# EAGLE design 3-channel_geo_amplifier (EAGLE 7.2.0)
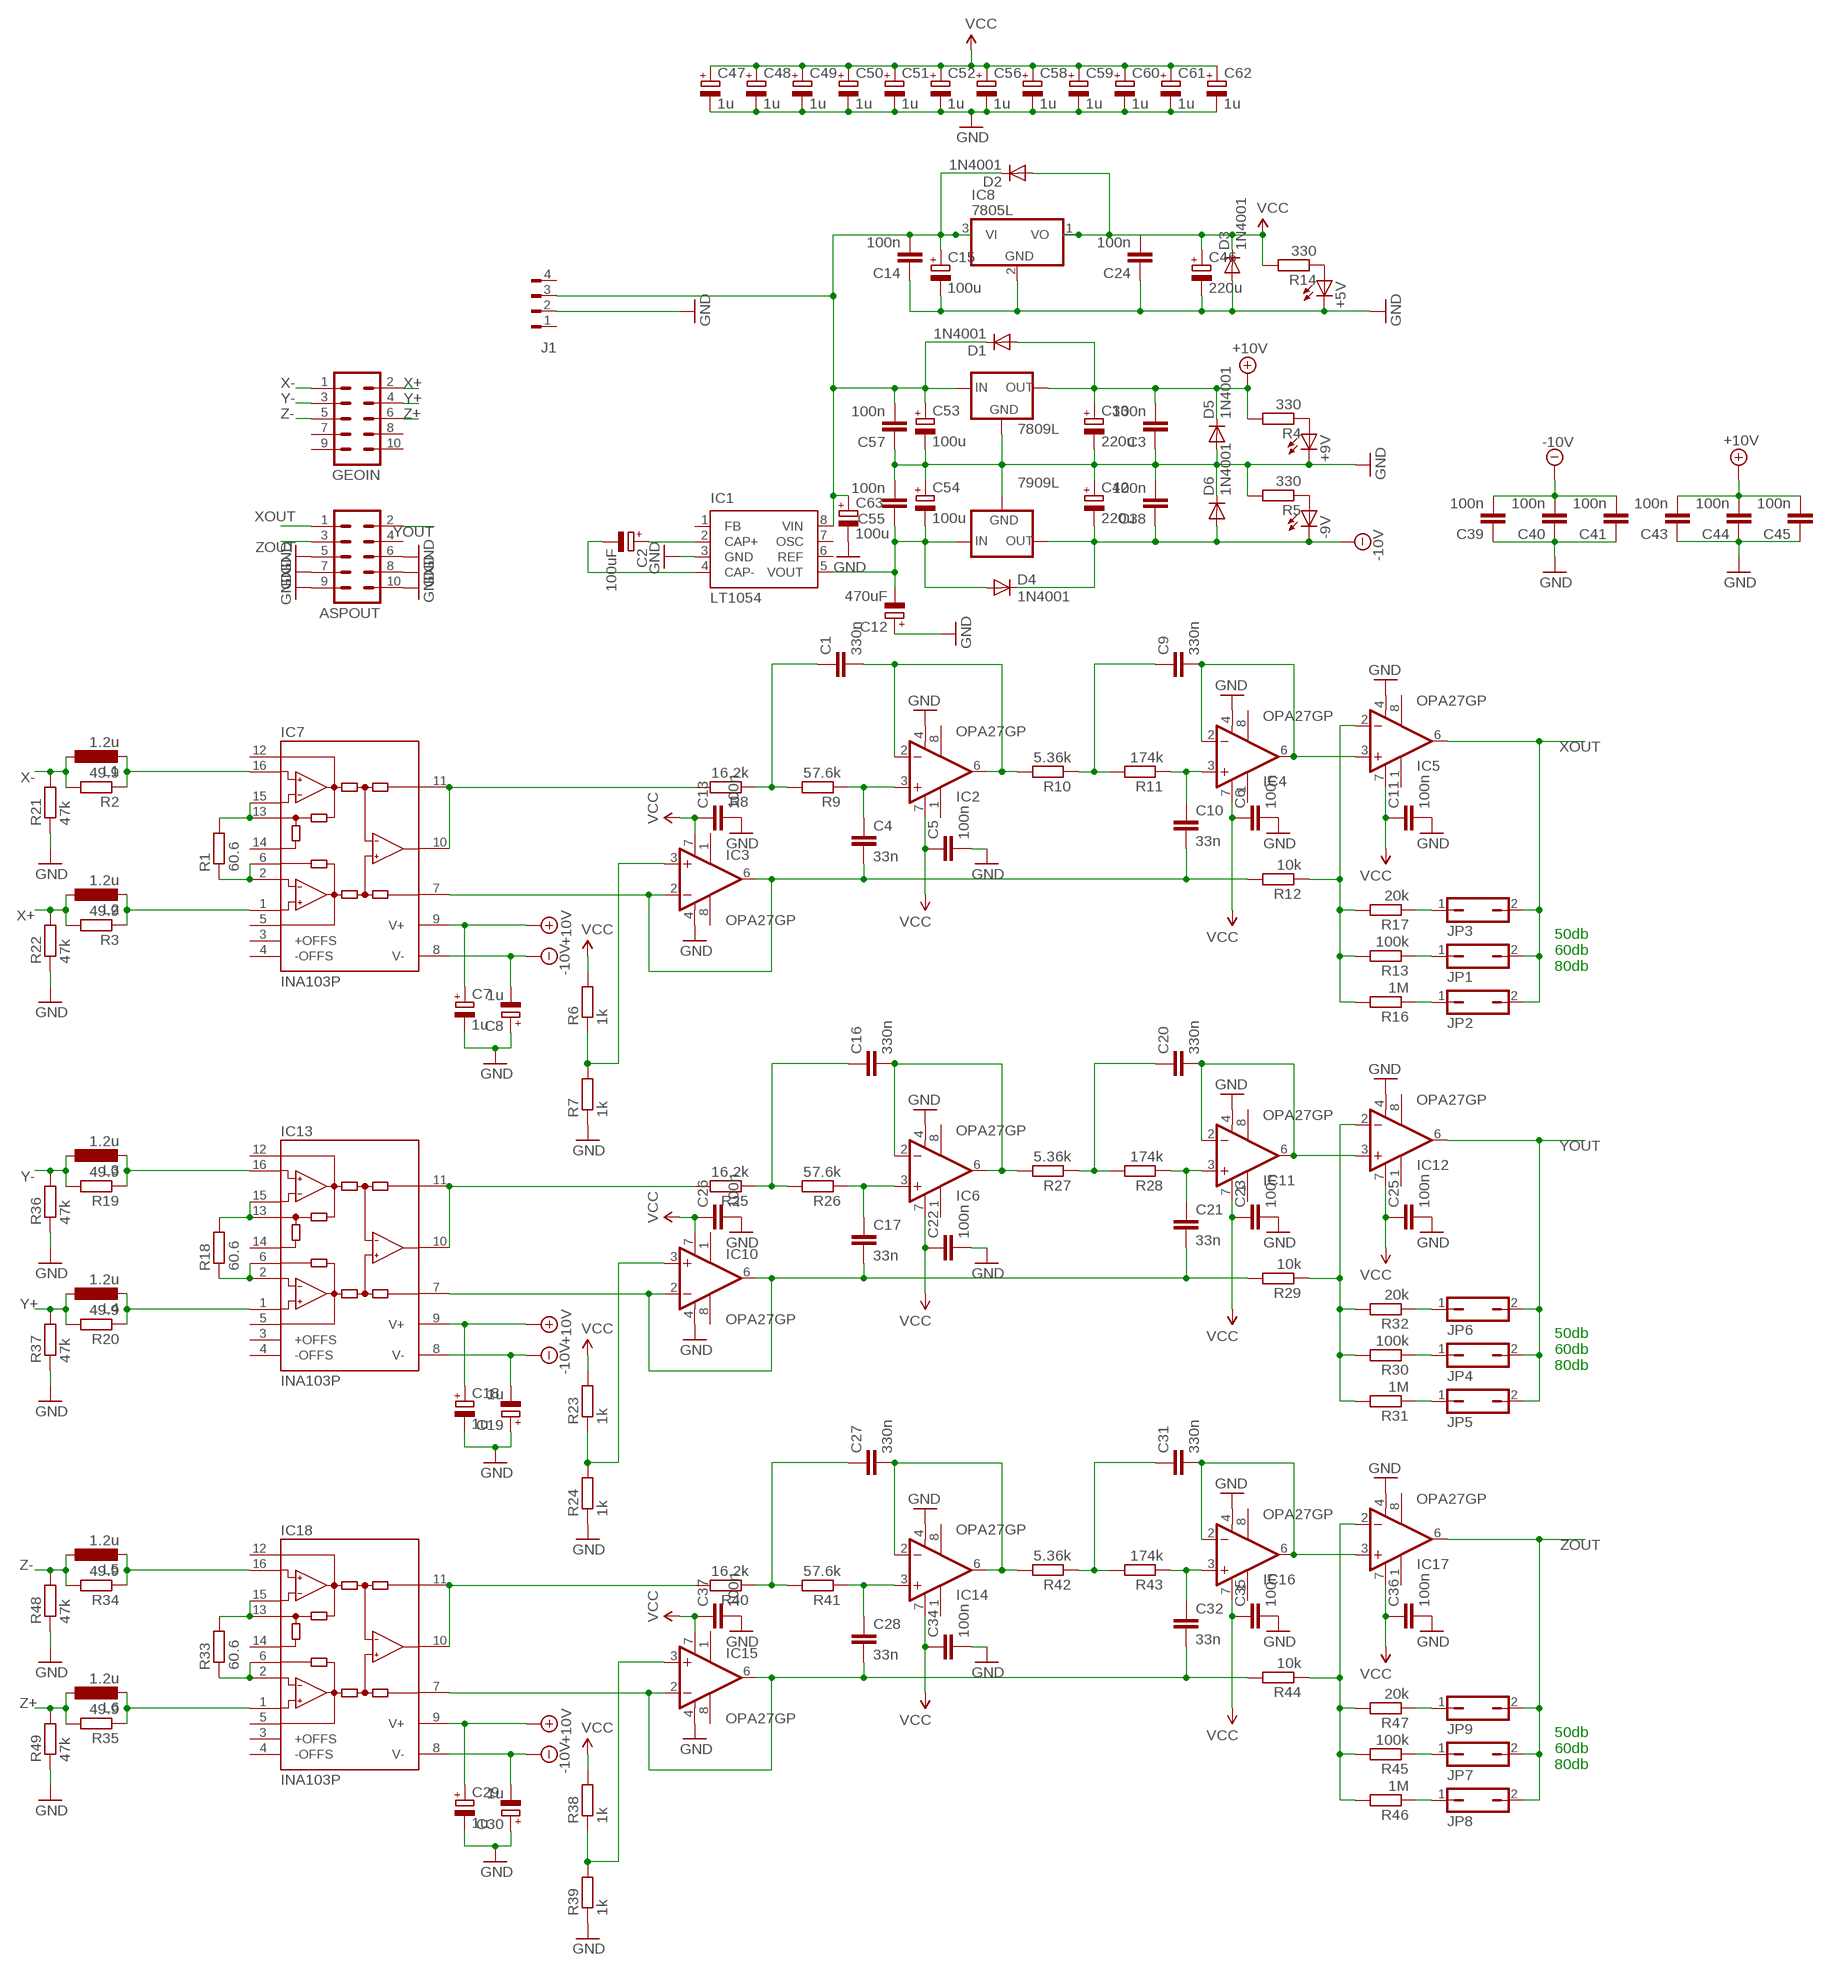
[diagram p0: schematic, sheet 1]

## Parts
7809L  78LXX  [78LXX]
7909L  79LXX  [79LXX]
+5V  LED3MM  [LED3MM]
+9V  LED3MM  [LED3MM]
-9V  LED3MM  [LED3MM]
ASPOUT  ML10  [ML10]
C1  330n  C-EU050-025X075  [C050-025X075]
C2  100uF  CPOL-EUE2.5-7  [E2,5-7]
C3  100n  C-EU050-025X075  [C050-025X075]
C4  33n  C-EU050-025X075  [C050-025X075]
C5  100n  C-EU050-025X075  [C050-025X075]
C6  100n  C-EU050-025X075  [C050-025X075]
C7  1u  CPOL-EUB45181A  [B45181A]
C8  1u  CPOL-EUB45181A  [B45181A]
C9  330n  C-EU050-025X075  [C050-025X075]
C10  33n  C-EU050-025X075  [C050-025X075]
C11  100n  C-EU050-025X075  [C050-025X075]
C12  470uF  CPOL-EUE5-8.5  [E5-8,5]
C13  100n  C-EU050-025X075  [C050-025X075]
C14  100n  C-EU050-025X075  [C050-025X075]
C15  100u  CPOL-EUE2.5-7  [E2,5-7]
C16  330n  C-EU050-025X075  [C050-025X075]
C17  33n  C-EU050-025X075  [C050-025X075]
C18  1u  CPOL-EUB45181A  [B45181A]
C19  1u  CPOL-EUB45181A  [B45181A]
C20  330n  C-EU050-025X075  [C050-025X075]
C21  33n  C-EU050-025X075  [C050-025X075]
C22  100n  C-EU050-025X075  [C050-025X075]
C23  100n  C-EU050-025X075  [C050-025X075]
C24  100n  C-EU050-025X075  [C050-025X075]
C25  100n  C-EU050-025X075  [C050-025X075]
C26  100n  C-EU050-025X075  [C050-025X075]
C27  330n  C-EU050-025X075  [C050-025X075]
C28  33n  C-EU050-025X075  [C050-025X075]
C29  1u  CPOL-EUB45181A  [B45181A]
C30  1u  CPOL-EUB45181A  [B45181A]
C31  330n  C-EU050-025X075  [C050-025X075]
C32  33n  C-EU050-025X075  [C050-025X075]
C33  220u  CPOL-EUE2.5-5  [E2,5-5]
C34  100n  C-EU050-025X075  [C050-025X075]
C35  100n  C-EU050-025X075  [C050-025X075]
C36  100n  C-EU050-025X075  [C050-025X075]
C37  100n  C-EU050-025X075  [C050-025X075]
C38  100n  C-EU050-025X075  [C050-025X075]
C39  100n  C-EU050-025X075  [C050-025X075]
C40  100n  C-EU050-025X075  [C050-025X075]
C41  100n  C-EU050-025X075  [C050-025X075]
C42  220u  CPOL-EUE2.5-5  [E2,5-5]
C43  100n  C-EU050-025X075  [C050-025X075]
C44  100n  C-EU050-025X075  [C050-025X075]
C45  100n  C-EU050-025X075  [C050-025X075]
C46  220u  CPOL-EUE2.5-7  [E2,5-7]
C47  1u  CPOL-EUB45181A  [B45181A]
C48  1u  CPOL-EUB45181A  [B45181A]
C49  1u  CPOL-EUB45181A  [B45181A]
C50  1u  CPOL-EUB45181A  [B45181A]
C51  1u  CPOL-EUB45181A  [B45181A]
C52  1u  CPOL-EUB45181A  [B45181A]
C53  100u  CPOL-EUE2.5-5  [E2,5-5]
C54  100u  CPOL-EUE2.5-5  [E2,5-5]
C55  100n  C-EU050-025X075  [C050-025X075]
C56  1u  CPOL-EUB45181A  [B45181A]
C57  100n  C-EU050-025X075  [C050-025X075]
C58  1u  CPOL-EUB45181A  [B45181A]
C59  1u  CPOL-EUB45181A  [B45181A]
C60  1u  CPOL-EUB45181A  [B45181A]
C61  1u  CPOL-EUB45181A  [B45181A]
C62  1u  CPOL-EUB45181A  [B45181A]
C63  100u  CPOL-EUE2.5-5  [E2,5-5]
D1  1N4001  1N4004  [DO41-10]
D2  1N4001  1N4004  [DO41-10]
D3  1N4001  1N4004  [DO41-10]
D4  1N4001  1N4004  [DO41-10]
D5  1N4001  1N4004  [DO41-10]
D6  1N4001  1N4004  [DO41-10]
GEOIN  ML10  [ML10]
IC1  LT1054  [DIL8]
IC2  OPA27GP  [DIL08]
IC3  OPA27GP  [DIL08]
IC4  OPA27GP  [DIL08]
IC5  OPA27GP  [DIL08]
IC6  OPA27GP  [DIL08]
IC7  INA103P  [DIL16]
IC8  7805L  [TO92]
IC10  OPA27GP  [DIL08]
IC11  OPA27GP  [DIL08]
IC12  OPA27GP  [DIL08]
IC13  INA103P  [DIL16]
IC14  OPA27GP  [DIL08]
IC15  OPA27GP  [DIL08]
IC16  OPA27GP  [DIL08]
IC17  OPA27GP  [DIL08]
IC18  INA103P  [DIL16]
J1  FLOP-4W827001  [827001]
JP1  JP1Q  [JP1]
JP2  JP1Q  [JP1]
JP3  JP1Q  [JP1]
JP4  JP1Q  [JP1]
JP5  JP1Q  [JP1]
JP6  JP1Q  [JP1]
JP7  JP1Q  [JP1]
JP8  JP1Q  [JP1]
JP9  JP1Q  [JP1]
L1  1.2u  L-EU0207/10  [0207/10]
L2  1.2u  L-EU0207/10  [0207/10]
L3  1.2u  L-EU0207/10  [0207/10]
L4  1.2u  L-EU0207/10  [0207/10]
L5  1.2u  L-EU0207/10  [0207/10]
L6  1.2u  L-EU0207/10  [0207/10]
R1  60.6  R-EU_0207/10  [0207/10]
R2  49.9  R-EU_0207/10  [0207/10]
R3  49.9  R-EU_0207/10  [0207/10]
R4  330  R-EU_0207/10  [0207/10]
R5  330  R-EU_0207/10  [0207/10]
R6  1k  R-EU_0207/10  [0207/10]
R7  1k  R-EU_0207/10  [0207/10]
R8  16.2k  R-EU_0207/10  [0207/10]
R9  57.6k  R-EU_0207/10  [0207/10]
R10  5.36k  R-EU_0207/10  [0207/10]
R11  174k  R-EU_0207/10  [0207/10]
R12  10k  R-EU_0207/10  [0207/10]
R13  100k  R-EU_0207/10  [0207/10]
R14  330  R-EU_0207/10  [0207/10]
R16  1M  R-EU_0207/10  [0207/10]
R17  20k  R-EU_0207/10  [0207/10]
R18  60.6  R-EU_0207/10  [0207/10]
R19  49.9  R-EU_0207/10  [0207/10]
R20  49.9  R-EU_0207/10  [0207/10]
R21  47k  R-EU_0207/10  [0207/10]
R22  47k  R-EU_0207/10  [0207/10]
R23  1k  R-EU_0207/10  [0207/10]
R24  1k  R-EU_0207/10  [0207/10]
R25  16.2k  R-EU_0207/10  [0207/10]
R26  57.6k  R-EU_0207/10  [0207/10]
R27  5.36k  R-EU_0207/10  [0207/10]
R28  174k  R-EU_0207/10  [0207/10]
R29  10k  R-EU_0207/10  [0207/10]
R30  100k  R-EU_0207/10  [0207/10]
R31  1M  R-EU_0207/10  [0207/10]
R32  20k  R-EU_0207/10  [0207/10]
R33  60.6  R-EU_0207/10  [0207/10]
R34  49.9  R-EU_0207/10  [0207/10]
R35  49.9  R-EU_0207/10  [0207/10]
R36  47k  R-EU_0207/10  [0207/10]
R37  47k  R-EU_0207/10  [0207/10]
R38  1k  R-EU_0207/10  [0207/10]
R39  1k  R-EU_0207/10  [0207/10]
R40  16.2k  R-EU_0207/10  [0207/10]
R41  57.6k  R-EU_0207/10  [0207/10]
R42  5.36k  R-EU_0207/10  [0207/10]
R43  174k  R-EU_0207/10  [0207/10]
R44  10k  R-EU_0207/10  [0207/10]
R45  100k  R-EU_0207/10  [0207/10]
R46  1M  R-EU_0207/10  [0207/10]
R47  20k  R-EU_0207/10  [0207/10]
R48  47k  R-EU_0207/10  [0207/10]
R49  47k  R-EU_0207/10  [0207/10]

## Nets
+10V [power]: 7809L.OUT C3.2 C7.+ C18.+ C29.+ C33.+ C43.2 C44.2 C45.2 D1.A D5.C IC7.9(V+) IC13.9(V+) IC18.9(V+) R4.2
-10V [power]: 7909L.OUT -9V.K(C) C8.- C19.- C30.- C38.1 C39.2 C40.2 C41.2 C42.- D4.C D6.A IC7.8(V-) IC13.8(V-) IC18.8(V-)
GND [power]: 7809L.GND 7909L.GND +5V.K(C) +9V.K(C) ASPOUT.5 ASPOUT.6 ASPOUT.7 ASPOUT.8 ASPOUT.9 ASPOUT.10 C3.1 C5.2 C6.2 C7.- C8.+ C11.2 C12.+ C13.2 C14.1 C15.- C18.- C19.+ C22.2 C23.2 C24.1 C25.2 C26.2 C29.- C30.+ C33.- C34.2 C35.2 C36.2 C37.2 C38.2 C39.1 C40.1 C41.1 C42.+ C43.1 C44.1 C45.1 C46.- C47.- C48.- C49.- C50.- C51.- C52.- C53.- C54.+ C55.2 C56.- C57.1 C58.- C59.- C60.- C61.- C62.- C63.- D3.A D5.A D6.C IC1.3(GND) IC2.4(V-) IC3.4(V-) IC4.4(V-) IC5.4(V-) IC6.4(V-) IC8.2(GND) IC10.4(V-) IC11.4(V-) IC12.4(V-) IC14.4(V-) IC15.4(V-) IC16.4(V-) IC17.4(V-) J1.2 R5.2 R7.1 R21.1 R22.1 R24.1 R36.1 R37.1 R39.1 R48.1 R49.1
N$1: IC7.13(-RG) IC7.15(-GS) R1.2
N$2: IC7.2(+GS) IC7.6(+RG) R1.1
N$3: IC7.1(+IN) L2.2 R3.1
N$6: IC7.16(-IN) L1.2 R2.1
N$7: C4.2 C10.2 IC3.2(-IN) IC3.6(OUT) IC7.7(REF) R12.2
N$8: IC3.3(+IN) R6.1 R7.2
N$9: IC7.10(OUT) IC7.11(SENSE) R8.2
N$10: C1.1 R8.1 R9.2
N$11: C4.1 IC2.3(+IN) R9.1
N$12: C1.2 IC2.2(-IN) IC2.6(OUT) R10.2
N$13: C9.2 IC4.2(-IN) IC4.6(OUT) IC5.3(+IN)
N$14: C9.1 R10.1 R11.2
N$15: C10.1 IC4.3(+IN) R11.1
N$16: +5V.A R14.1
N$17: IC5.2(-IN) R12.1 R13.2 R16.2 R17.2
N$18: JP1.1 R13.1
N$20: +9V.A R4.1
N$21: IC13.13(-RG) IC13.15(-GS) R18.2
N$22: JP2.1 R16.1
N$23: IC13.2(+GS) IC13.6(+RG) R18.1
N$24: JP3.1 R17.1
N$25: IC13.1(+IN) L4.2 R20.1
N$26: C2.- IC1.4(CAP-)
N$27: C2.+ IC1.2(CAP+)
N$28: IC13.16(-IN) L3.2 R19.1
N$29: C17.2 C21.2 IC10.2(-IN) IC10.6(OUT) IC13.7(REF) R29.2
N$30: IC10.3(+IN) R23.1 R24.2
N$31: IC13.10(OUT) IC13.11(SENSE) R25.2
N$32: C16.1 R25.1 R26.2
N$33: C17.1 IC6.3(+IN) R26.1
N$34: C16.2 IC6.2(-IN) IC6.6(OUT) R27.2
N$35: C20.1 R27.1 R28.2
N$36: C21.1 IC11.3(+IN) R28.1
N$37: C20.2 IC11.2(-IN) IC11.6(OUT) IC12.3(+IN)
N$38: IC12.2(-IN) R29.1 R30.2 R31.2 R32.2
N$39: -9V.A R5.1
N$40: JP4.1 R30.1
N$41: JP5.1 R31.1
N$42: JP6.1 R32.1
N$43: IC18.13(-RG) IC18.15(-GS) R33.2
N$44: IC18.2(+GS) IC18.6(+RG) R33.1
N$45: IC18.1(+IN) L6.2 R35.1
N$46 [power]: 7809L.IN C14.2 C15.+ C53.+ C57.2 C63.+ D1.C D2.C IC1.8(VIN) IC8.3(VI) J1.3
N$52: IC18.16(-IN) L5.2 R34.1
N$53: C28.2 C32.2 IC15.2(-IN) IC15.6(OUT) IC18.7(REF) R44.2
N$54: IC15.3(+IN) R38.1 R39.2
N$55: IC18.10(OUT) IC18.11(SENSE) R40.2
N$56: C27.1 R40.1 R41.2
N$57: C28.1 IC14.3(+IN) R41.1
N$58 [power]: 7909L.IN C12.- C54.- C55.1 D4.A IC1.5(VOUT)
N$60: C27.2 IC14.2(-IN) IC14.6(OUT) R42.2
N$61: C31.1 R42.1 R43.2
N$62: C32.1 IC16.3(+IN) R43.1
N$63: C31.2 IC16.2(-IN) IC16.6(OUT) IC17.3(+IN)
N$64: IC17.2(-IN) R44.1 R45.2 R46.2 R47.2
N$66: JP7.1 R45.1
N$67: JP8.1 R46.1
N$68: JP9.1 R47.1
VCC [power]: C5.1 C6.1 C11.1 C13.1 C22.1 C23.1 C24.2 C25.1 C26.1 C34.1 C35.1 C36.1 C37.1 C46.+ C47.+ C48.+ C49.+ C50.+ C51.+ C52.+ C56.+ C58.+ C59.+ C60.+ C61.+ C62.+ D2.A D3.C IC2.7(V+) IC3.7(V+) IC4.7(V+) IC5.7(V+) IC6.7(V+) IC8.1(VO) IC10.7(V+) IC11.7(V+) IC12.7(V+) IC14.7(V+) IC15.7(V+) IC16.7(V+) IC17.7(V+) R6.2 R14.2 R23.2 R38.2
X+: GEOIN.2 L2.1 R3.2 R22.2
X-: GEOIN.1 L1.1 R2.2 R21.2
XOUT: ASPOUT.1 IC5.6(OUT) JP1.2 JP2.2 JP3.2
Y+: GEOIN.4 L4.1 R20.2 R37.2
Y-: GEOIN.3 L3.1 R19.2 R36.2
YOUT: ASPOUT.2 IC12.6(OUT) JP4.2 JP5.2 JP6.2
Z+: GEOIN.6 L6.1 R35.2 R49.2
Z-: GEOIN.5 L5.1 R34.2 R48.2
ZOUT: ASPOUT.3 IC17.6(OUT) JP7.2 JP8.2 JP9.2
Unconnected: ASPOUT.4 GEOIN.7 GEOIN.8 GEOIN.9 GEOIN.10 IC1.1(FB) IC1.6(REF) IC1.7(OSC) IC2.1(OFF1) IC2.8(OFF2) IC3.1(OFF1) IC3.8(OFF2) IC4.1(OFF1) IC4.8(OFF2) IC5.1(OFF1) IC5.8(OFF2) IC6.1(OFF1) IC6.8(OFF2) IC7.3(+OFFS) IC7.4(-OFFS) IC7.5(+GD) IC7.12(-GD) IC7.14(G=100) IC10.1(OFF1) IC10.8(OFF2) IC11.1(OFF1) IC11.8(OFF2) IC12.1(OFF1) IC12.8(OFF2) IC13.3(+OFFS) IC13.4(-OFFS) IC13.5(+GD) IC13.12(-GD) IC13.14(G=100) IC14.1(OFF1) IC14.8(OFF2) IC15.1(OFF1) IC15.8(OFF2) IC16.1(OFF1) IC16.8(OFF2) IC17.1(OFF1) IC17.8(OFF2) IC18.3(+OFFS) IC18.4(-OFFS) IC18.5(+GD) IC18.12(-GD) IC18.14(G=100) J1.1 J1.4

## Notes on the sheet
- 50db
  60db
  80db
- 50db
  60db
  80db
- 50db
  60db
  80db

## Library data of the parts
7809L = v-reg:78LXX: VOLTAGE REGULATOR
7909L = v-reg:79LXX: VOLTAGE REGULATOR
+5V +9V -9V = led:LED: LED OSRAM: - CHIPLED LG R971, LG N971, LY N971, LG Q971, LY Q971, LO R971, LY R971 LH N974, LH R974 LS Q976, LO Q976, LY Q976 LO Q996 - Hyper CHIPLED LW Q18S LB Q993, LB Q99A, LB R99A - SideLED LS A670, LO A670, LY A670, LG A670, LP A670 LB A673, LV A673, LT A673, LW A673 LH A674 LY A675 LS A676, LA A676, LO A676, LY A676, LW A676 LS A679, LY A679, LG A679 - Hyper Micro SIDELED® LS Y876, LA Y876, LO Y876, LY Y876 LT Y87S - SmartLED LW L88C, LW L88S LB L89C, LB L89S, LG L890 LS L89K, LO L89K, LY L89K LS L896, LA L896, LO L896, LY L896 - TOPLED LS T670, LO T670, LY T670, LG T670, LP T670 LSG T670, LSP T670, LSY T670, LOP T670, LYG T670 LG T671, LOG T671, LSG T671 LB T673, LV T673, LT T673, LW T673 LH T674 LS T676, LA T676, LO T676, LY T676, LB T676, LH T676, LSB T676, LW T676 LB T67C, LV T67C, LT T67C, LS T67K, LO T67K, LY T67K, LW E67C LS E67B, LA E67B, LO E67B, LY E67B, LB E67C, LV E67C, LT E67C LW T67C LS T679, LY T679, LG T679 LS T770, LO T770, LY T770, LG T770, LP T770 LB T773, LV T773, LT T773, LW T773 LH T774 LS E675, LA E675, LY E675, LS T675 LS T776, LA T776, LO T776, LY T776, LB T776 LHGB T686 LT T68C, LB T68C - Hyper Mini TOPLED® LB M676 - Mini TOPLED Santana® LG M470 LS M47K, LO M47K, LY M47K Source: http://www.osram.convergy.de LUXEON: - LUMILED® LXK2-PW12-R00, LXK2-PW12-S00, LXK2-PW14-U00, LXK2-PW14-V00 LXK2-PM12-R00, LXK2-PM12-S00, LXK2-PM14-U00 LXK2-PE12-Q00, LXK2-PE12-R00, LXK2-PE12-S00, LXK2-PE14-T00, LXK2-PE14-U00 LXK2-PB12-K00, LXK2-PB12-L00, LXK2-PB12-M00, LXK2-PB14-N00, LXK2-PB14-P00, LXK2-PB14-Q00 LXK2-PR12-L00, LXK2-PR12-M00, LXK2-PR14-Q00, LXK2-PR14-R00 LXK2-PD12-Q00, LXK2-PD12-R00, LXK2-PD12-S00 LXK2-PH12-R00, LXK2-PH12-S00 LXK2-PL12-P00, LXK2-PL12-Q00, LXK2-PL12-R00 Source: www.luxeon.com KINGBRIGHT: KA-3528ASYC Source: www.kingbright.com
ASPOUT GEOIN = con-ml:ML10: HARTING; OC_FARNELL: unknown; OC_NEWARK: unknown
C1 C3-C6 C9-C11 C13 C14 C16 C17 C20-C28 C31 C32 C34-C41 C43-C45 C55 C57 = rcl:C-EU: CAPACITOR, European symbol
C2 C7 C8 C12 C15 C18 C19 C29 C30 C33 C42 C46-C54 C56 C58-C63 = rcl:CPOL-EU: POLARIZED CAPACITOR, European symbol
D1-D6 = diode:1N4004: DIODE general purpose rectifier, 1 A
IC1 = mylib2:LT1054
IC2-IC6 IC10-IC12 IC14-IC17 = linear:OPA*?: Ultra-Low Noise, Precision OP AMP Source: http://focus.ti.com/lit/ds/symlink/opa27.pdf http://focus.ti.com .. opa241.pdf
IC7 IC13 IC18 = burr-brown:INA103: Instrumentation Amplifier Low Distortion, Low Noise; MF: TEXAS INSTRUMENTS; MPN: INA103KP; OC_FARNELL: 1212392; OC_NEWARK: 74K3805
IC8 = linear:78*: Positive VOLTAGE REGULATOR Source: http://cache.national.com/ds/LM/LM78L05.pdf http://www.fairchildsemi.com/ds/LM/LM7805.pdf
J1 = con-amp:FLOP-4W: MATE N-LOCK Floppy / HDD conector Distributor: Bürklin 71F972
JP1-JP9 = jumper:JP1Q: JUMPER
L1-L6 = rcl:L-EU: INDUCTOR, European symbol
R1-R14 R16-R49 = rcl:R-EU_: RESISTOR, European symbol

## Net classes
0 default: clearance 0.205 mm
2 power: width 0.559 mm, clearance 0.205 mm to class 0, clearance 0.205 mm to class 1, clearance 0.205 mm
3 extra_power: width 0.762 mm, clearance 0.203 mm

## Board
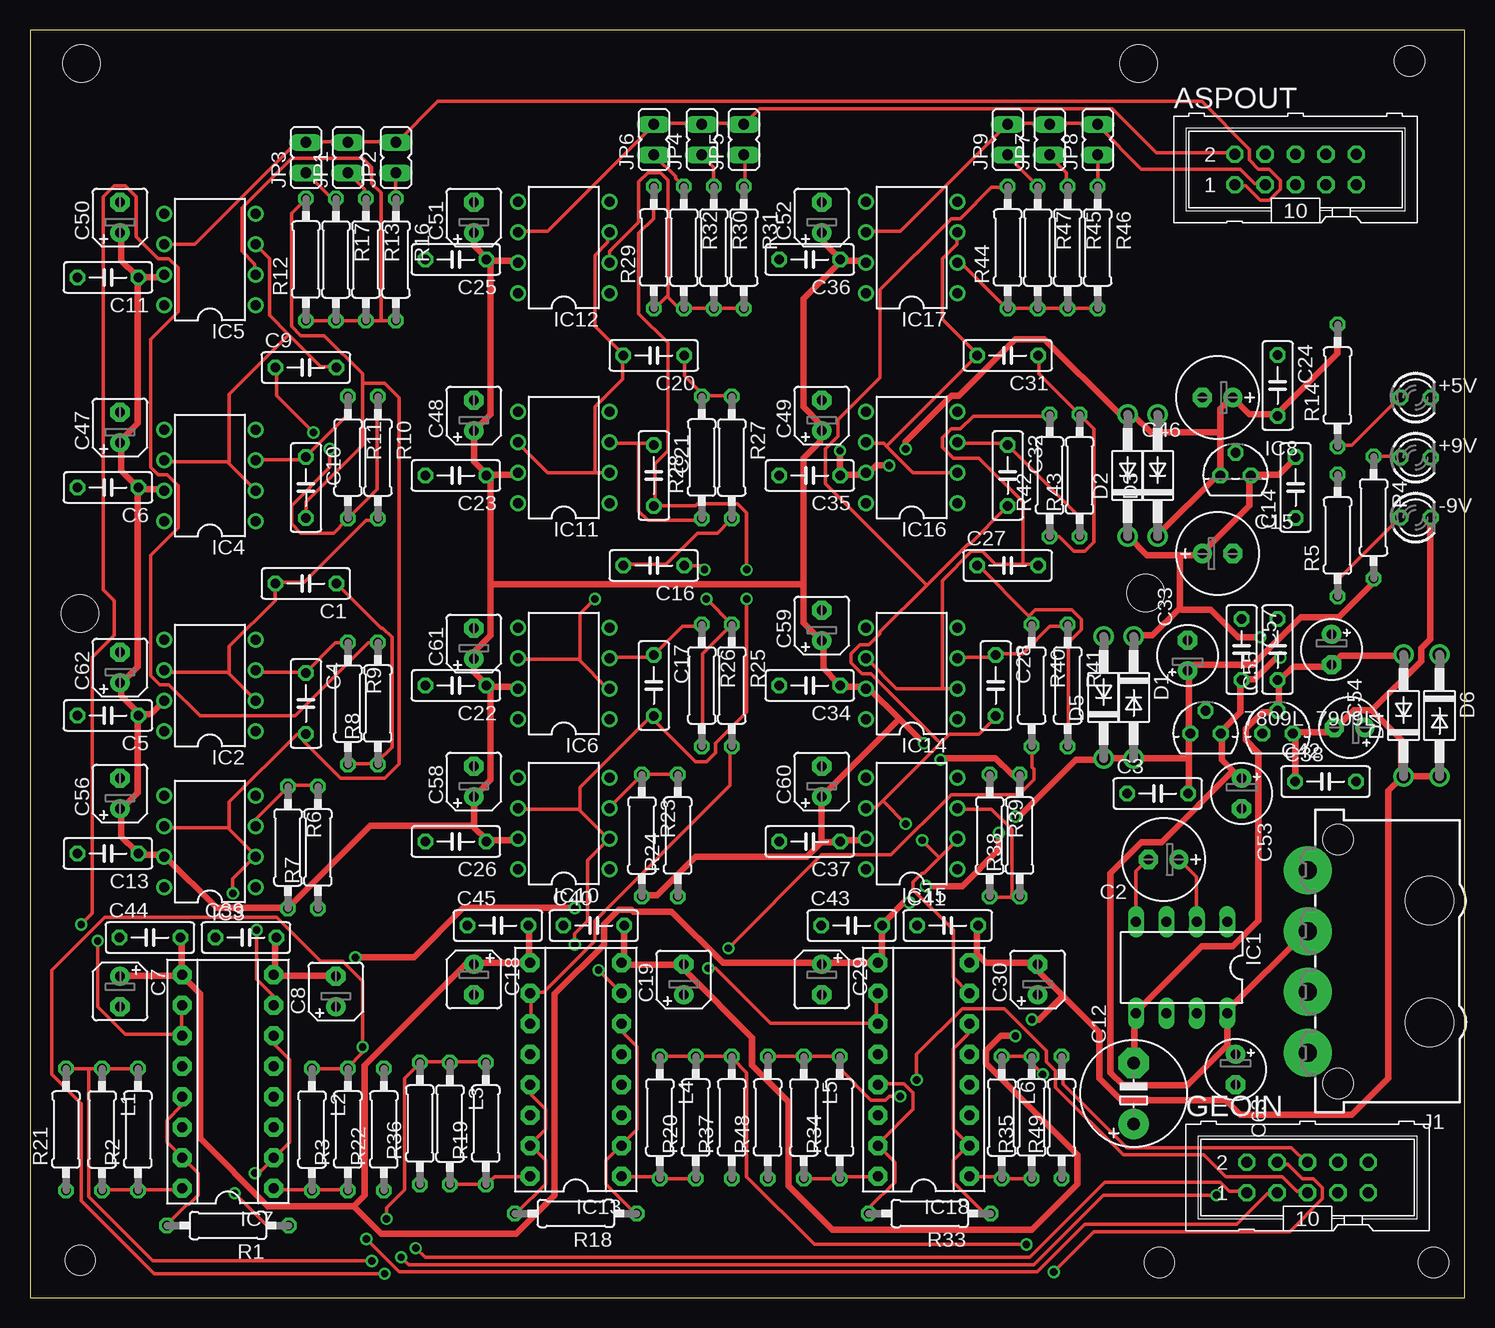
[diagram p1: board, top side]
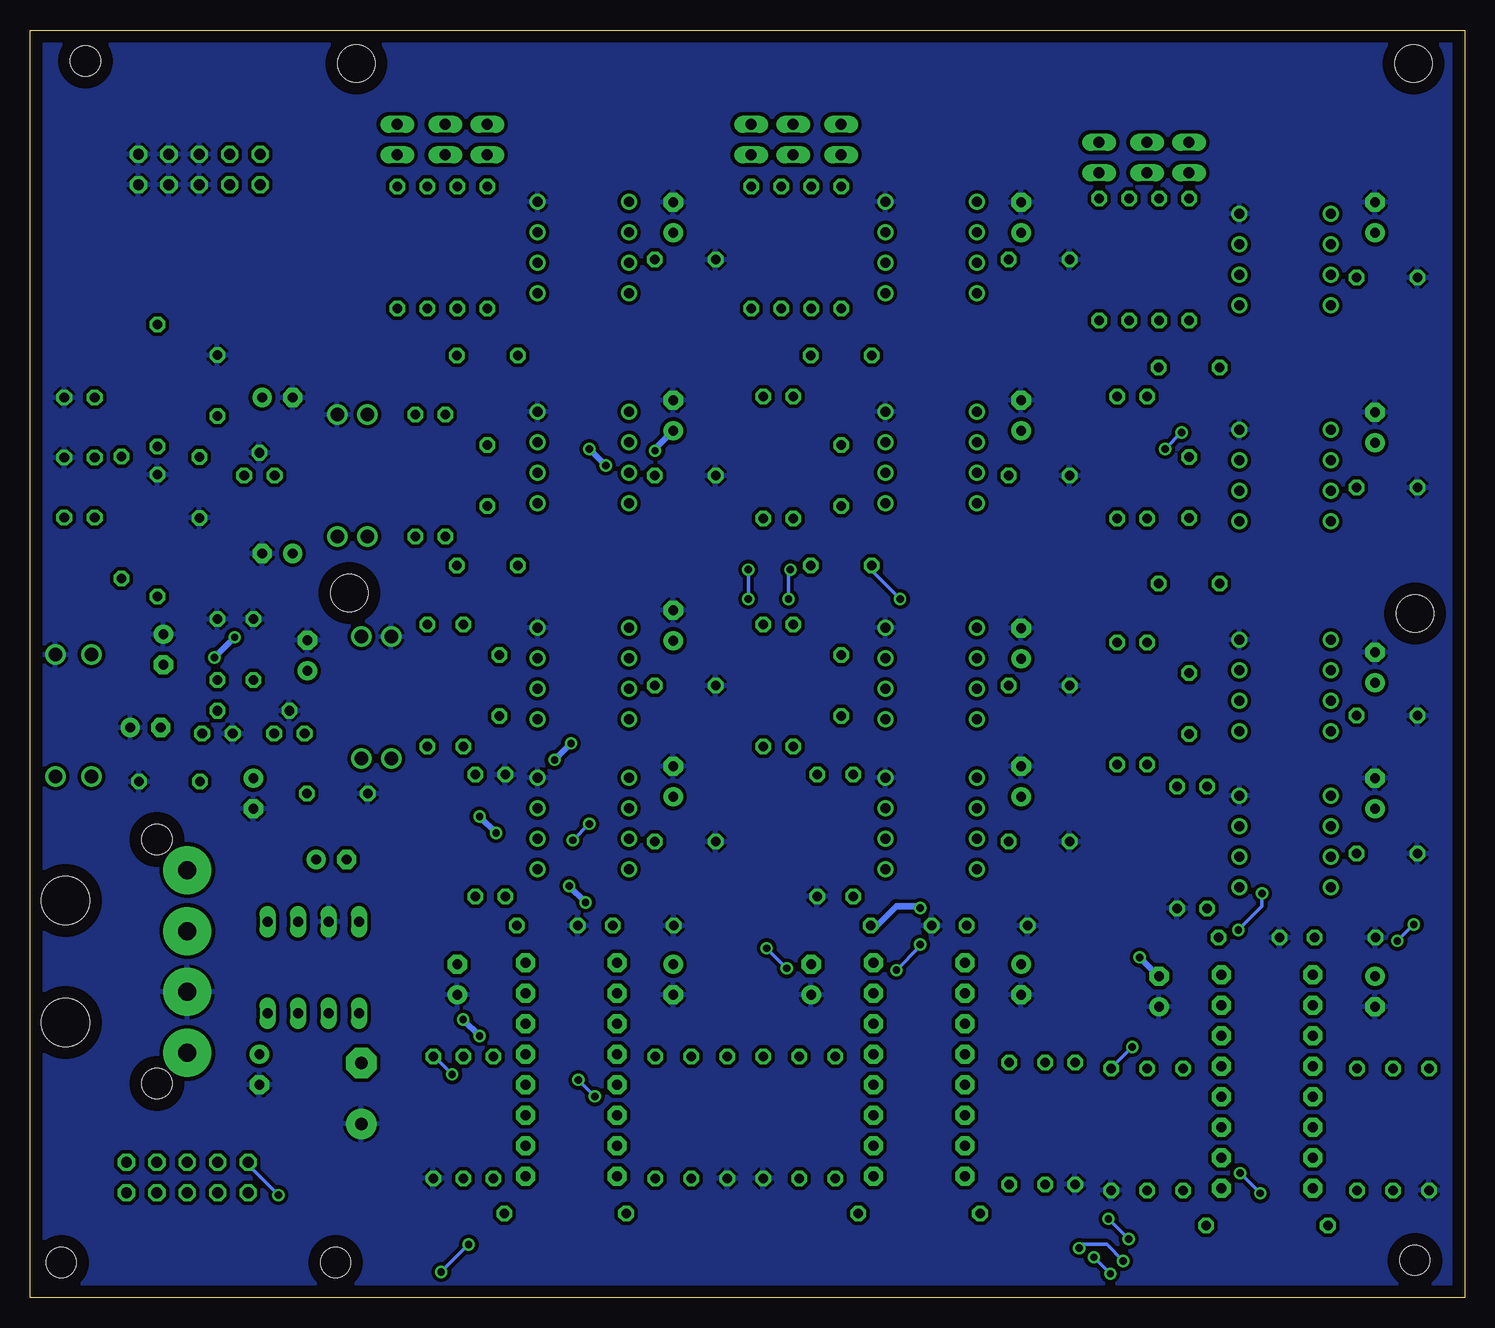
[diagram p2: board, bottom side, seen from below]

Size 119.62 x 105.63 mm. Coordinates in mm from the lower left corner, seen from the top.
Outline: 0,0 119.62,0 119.62,105.63 0,105.59 0,0
Copper layers (1*16): Top 0.035mm / dielectric 1.5mm / Bottom 0.035mm
Design rules "default *": minimum track width 12mil, minimum drill 24mil, track to track 12mil, track to pad 12mil, pad to pad 12mil, via to via 12mil, smd to smd 12mil, copper to edge 40mil, drill to drill 8mil, minimum pad ring 10mil, minimum via ring 8mil, stop-mask expansion 4mil, vias tented up to drill 0mil, thermal gap 10mil
Holes 2.5 mm at 94.15,2.92 4.18,3.1 117.01,2.92 115,103.05
Holes 3.1 mm at 4.29,102.82 92.41,102.84 4.18,57 93,58.72

### Footprints (pad centres in the part's own frame; a part is rotated, then mirrored left to right if it is on the bottom)
78LXX = drill 0.813 octagon: GND 0,1.905; IN 1.27,0; OUT -1.27,0
79LXX = drill 0.813 octagon: GND -1.27,0; IN 0,1.905; OUT 1.27,0
LED3MM = drill 0.813 octagon: A -1.27,0; K 1.27,0
ML10 = drill 0.914 octagon: 1 -5.08,-1.27; 2 -5.08,1.27; 3 -2.54,-1.27; 4 -2.54,1.27; 5 0,-1.27; 6 0,1.27; 7 2.54,-1.27; 8 2.54,1.27; 9 5.08,-1.27; 10 5.08,1.27
C050-025X075 = drill 0.813 octagon: 1 -2.54,0; 2 2.54,0
E2,5-7 = drill 0.813 pad 1.6: + -1.27,0 | drill 0.813 pad 1.6 octagon: - 1.27,0
B45181A = drill 0.813 pad 1.6: + -1.27,0 | drill 0.813 pad 1.6 octagon: - 1.27,0
E5-8,5 = drill 1.016 pad 2.54: + -2.54,0 | drill 1.016 pad 2.54 octagon: - 2.54,0
E2,5-5 = drill 0.813 pad 1.6: + -1.27,0 | drill 0.813 pad 1.6 octagon: - 1.27,0
DO41-10 = drill 1.118: A 5.08,0; C -5.08,0
DIL8 = drill 0.813 long: 1 -3.81,-3.81; 2 -1.27,-3.81; 3 1.27,-3.81; 4 3.81,-3.81; 5 3.81,3.81; 6 1.27,3.81; 7 -1.27,3.81; 8 -3.81,3.81
DIL08 = drill 0.813 pad 1.27: 1 -3.81,-3.81; 2 -1.27,-3.81; 3 1.27,-3.81; 4 3.81,-3.81; 5 3.81,3.81; 6 1.27,3.81; 7 -1.27,3.81; 8 -3.81,3.81
DIL16 = drill 0.813 pad 1.6 octagon: 1 -8.89,-3.81; 2 -6.35,-3.81; 3 -3.81,-3.81; 4 -1.27,-3.81; 5 1.27,-3.81; 6 3.81,-3.81; 7 6.35,-3.81; 8 8.89,-3.81; 9 8.89,3.81; 10 6.35,3.81; 11 3.81,3.81; 12 1.27,3.81; 13 -1.27,3.81; 14 -3.81,3.81; 15 -6.35,3.81; 16 -8.89,3.81
TO92 = drill 0.813 octagon: 1 -1.27,0; 2 0,1.905; 3 1.27,0
827001 = drill 1.5 pad 4: 1 -7.62,0; 2 -2.54,0; 3 2.54,0; 4 7.62,0 | hole 4: 5.08,-10.16; -5.08,-10.16 | hole 2.5: 10.16,-2.54; -10.16,-2.54
JP1 = drill 0.914 long: 1 0,-1.27; 2 0,1.27
0207/10 = drill 0.813 octagon: 1 -5.08,0; 2 5.08,0

### Placement (x,y rotation side)
7809L  98,47 0 top
7909L  104,47 0 top
+5V  115.5,75 0 top
+9V  115.5,70 0 top
-9V  115.5,65 0 top
ASPOUT  105.5,94 0 top
C1  23,59.5 180 top
C2  94.5,36.5 180 top
C3  94,42 0 top
C4  23,49.5 270 top
C5  6.5,48.5 180 top
C6  6.5,67.5 180 top
C7  7.5,25.5 270 top
C8  25.5,25.5 90 top
C9  23,77.5 0 top
C10  23,67.5 270 top
C11  6.5,85 180 top
C12  92,17 90 top
C13  6.5,37 180 top
C14  105.5,67.5 90 top
C15  99,62 0 top
C16  52,61 180 top
C17  52,51 270 top
C18  37,26.5 270 top
C19  54.5,26.5 90 top
C20  52,78.5 180 top
C21  52,68.5 270 top
C22  35.5,51 180 top
C23  35.5,68.5 180 top
C24  104,76 270 top
C25  35.5,86.5 180 top
C26  35.5,38 180 top
C27  81.5,61 0 top
C28  80.5,51 270 top
C29  66,26.5 270 top
C30  84,26.5 90 top
C31  81.5,78.5 180 top
C32  81.5,68.5 270 top
C33  96.5,53.5 90 top
C34  65,51 180 top
C35  65,68.5 180 top
C36  65,86.5 180 top
C37  65,38 180 top
C38  108,43 0 top
C39  18,30 0 top
C40  47,31 0 top
C41  76.5,31 0 top
C42  110,47.5 180 top
C43  68.5,31 0 top
C44  10,30 0 top
C45  39,31 0 top
C46  99,75 180 top
C47  7.5,72.5 90 top
C48  37,73.5 90 top
C49  66,73.5 90 top
C50  7.5,90 90 top
C51  37,90 90 top
C52  66,90 90 top
C53  101,42 270 top
C54  108.5,54 270 top
C55  104,54 90 top
C56  7.5,42 90 top
C57  101,54 270 top
C58  37,43 90 top
C59  66,56 90 top
C60  66,43 90 top
C61  37,54.5 90 top
C62  7.5,52.5 90 top
C63  100.5,19 270 top
D1  92,50 270 top
D2  91.5,68.5 90 top
D3  94,68.5 90 top
D4  114.5,48.5 90 top
D5  89.5,50 90 top
D6  117.5,48.5 270 top
GEOIN  106.5,10 0 top
IC1  96,27.5 180 top
IC2  15,51 90 top
IC3  15,38 90 top
IC4  15,68.5 90 top
IC5  15,86.5 90 top
IC6  44.5,52 90 top
IC7  16.5,18 90 top
IC8  100.5,68.5 0 top
IC10  44.5,39.5 90 top
IC11  44.5,70 90 top
IC12  44.5,87.5 90 top
IC13  45.5,19 90 top
IC14  73.5,52 90 top
IC15  73.5,39.5 90 top
IC16  73.5,70 90 top
IC17  73.5,87.5 90 top
IC18  74.5,19 90 top
J1  106.5,28 90 top
JP1  26.5,95 0 top
JP2  30.5,95 0 top
JP3  23,95 0 top
JP4  56,96.5 0 top
JP5  59.5,96.5 0 top
JP6  52,96.5 0 top
JP7  85,96.5 0 top
JP8  89,96.5 0 top
JP9  81.5,96.5 0 top
L1  6,14 270 top
L2  23.5,14 270 top
L3  35,14.5 270 top
L4  52.5,15 270 top
L5  64.5,15 270 top
L6  81,15 270 top
R1  16.5,6 180 top
R2  9,14 90 top
R3  26.5,14 90 top
R4  112,65 270 top
R5  109,63.5 90 top
R6  21.5,37.5 270 top
R7  24,37.5 90 top
R8  29,49.5 90 top
R9  26.5,49.5 270 top
R10  29,70 270 top
R11  26.5,70 270 top
R12  23,86.5 90 top
R13  28,86.5 270 top
R14  109,76 90 top
R16  30.5,86.5 270 top
R17  25.5,86.5 270 top
R18  45.5,7 180 top
R19  38,14.5 90 top
R20  55.5,15 90 top
R21  3,14 90 top
R22  29.5,14 90 top
R23  51,38.5 270 top
R24  54,38.5 90 top
R25  58.5,51 270 top
R26  56,51 270 top
R27  58.5,70 270 top
R28  56,70 90 top
R29  52,87.5 90 top
R30  57,87.5 270 top
R31  59.5,87.5 270 top
R32  54.5,87.5 270 top
R33  75,7 180 top
R34  67.5,15 90 top
R35  83.5,15 90 top
R36  32.5,14.5 90 top
R37  58.5,15 90 top
R38  82.5,38.5 90 top
R39  80,38.5 270 top
R40  83.5,51 270 top
R41  86.5,51 270 top
R42  85,68.5 90 top
R43  87.5,68.5 90 top
R44  81.5,87.5 90 top
R45  86.5,87.5 270 top
R46  89,87.5 270 top
R47  84,87.5 270 top
R48  61.5,15 90 top
R49  86,15 90 top

### Tracks (layer width: path | path; a pad name or v marks a point on that pad's centre or on a via)
+10V  (via drill 0.61)
  Top 0.559: 96.62,44.96 96.62,46.94 7809L.OUT 96.62,47.24 96.62,52.12 C33.+ 96.62,52.27 97.08,52.73 101.96,52.73 105.92,56.69 109.12,56.69 111.86,59.44 111.86,59.89 R4.2 | 96.62,44.96 96.62,42.06 C3.2 | 96.62,44.96 92.2,44.96 D1.A 91.9,44.96 89.61,44.96 D5.C 89.31,44.81 87.17,44.81 82.45,40.08 v82.14,40.08 | C45.2 41.6,30.94 41.6,28.04 IC13.9 41.45,27.89 37.03,27.89 C18.+ 36.73,27.74 36.27,27.74 27.89,19.36 27.89,8.53 26.98,7.62 | C44.2 12.65,29.87 12.65,26.98 IC7.9 | C7.+ 7.62,26.82 12.5,26.82 IC7.9 | 26.98,7.62 19.81,7.62 14.17,13.26 14.17,25.3 12.8,26.67 IC7.9 | 26.98,7.62 29.26,5.33 40.54,5.33 43.74,8.53 43.74,25.3 47.85,29.41 47.85,31.09 49.07,32.31 50.14,32.31 50.29,32.16 53.49,32.16 57.76,27.89 65.84,27.89 C29.+ 66.14,27.89 70.41,27.89 IC18.9 70.71,28.04 71.02,28.35 71.02,30.94 C43.2 71.17,31.24 72.85,32.92 v73.3,32.92 | v80.77,38.71 80.77,37.34 77.72,34.29 v74.68,34.29
  Bottom 0.559: v80.77,38.71 v82.14,40.08 | v73.3,32.92 v74.68,34.29
-10V  (via drill 0.61)
  Top 0.559: C39.2 20.42,29.87 20.42,26.98 IC7.8 20.57,26.82 25.45,26.82 C8.- | C40.2 49.53,30.94 49.53,28.19 49.38,28.04 IC13.8 49.53,27.74 54.41,27.74 C19.- 54.71,27.58 54.71,27.13 60.2,21.64 60.2,19.36 63.25,16.31 63.25,9.3 66.9,5.64 83.52,5.64 87.33,9.45 87.33,11.89 79.7,19.51 79.7,20.57 80.92,21.79 v82.14,21.79 | v27.13,28.35 32,28.35 36.12,32.46 v45.41,32.46 | 78.94,28.65 78.94,30.94 C41.2 | 78.94,28.65 78.33,28.04 IC18.8 | 78.94,28.65 79.7,27.89 83.97,27.89 C30.- 84.12,27.58 84.12,27.13 86.11,25.15 | D4.C 114.61,43.43 117.35,43.43 D6.A | C38.1 105.46,43.13 105.46,46.79 7909L.OUT 105.31,47.09 108.36,47.09 108.66,47.4 C42.- 108.97,47.55 110.34,48.92 111.86,48.92 | 111.86,48.92 115.98,53.03 115.98,54.1 116.74,54.86 116.74,64.92 -9V.K | 111.86,48.92 114.3,46.48 114.3,43.59 D4.C | 86.11,25.15 89.15,22.1 89.15,18.29 90.98,16.46 99.67,16.46 100.89,15.24 110.19,15.24 113.23,18.29 113.23,42.22 114.3,43.28 D4.C | v83.52,23.16 84.12,23.16 86.11,25.15
  Bottom 0.559: v27.13,28.35 25.6,26.82 C8.- | v45.41,32.46 45.57,32.61 47.4,32.61 49.07,30.94 49.53,30.94 C40.2 | v83.52,23.16 v82.14,21.79
GND
  pour Bottom (isolate 0.305): 120.28,105.49 120.28,-0.25 0.26,-0.25 0.26,105.49
N$1
  Top 0.305: R1.2 11.43,6.1 13.11,7.77 13.26,7.77 14.02,8.53 14.02,10.36 12.8,11.58 IC7.15 12.65,11.73 11.43,12.95 11.43,14.78 12.65,16 12.65,16.61 IC7.13
N$2  (via drill 0.61)
  Top 0.305: v17.07,8.69 19.66,6.1 21.49,6.1 R1.1 | v18.75,10.36 19.05,10.36 20.27,11.58 IC7.2 20.42,11.73 21.64,12.95 21.64,19.81 20.42,21.03 20.42,21.79 IC7.6
  Bottom 0.305: v18.75,10.36 v17.07,8.69
N$3
  Top 0.305: R3.1 26.36,8.99 23.62,8.99 L2.2 23.47,8.99 20.42,8.99 IC7.1
N$6
  Top 0.305: L1.2 6.1,8.99 8.99,8.99 R2.1 9.14,8.99 12.65,8.99 IC7.16
N$7  (via drill 0.61)
  Top 0.305: 27.74,76.2 27.74,76.96 24.54,80.16 22.55,80.16 21.79,80.92 21.79,90.37 R12.2 | 27.74,76.2 27.74,71.02 23.01,66.29 23.01,65.08 C10.2 | 16.54,39.09 18.75,36.88 IC3.2 18.75,36.73 16.92,34.9 v16.92,33.68 | 16.54,39.09 16.46,39.17 11.28,39.17 IC3.6 | 16.54,39.09 16.61,39.17 16.61,41.3 22.25,46.94 22.86,46.94 C4.2 22.86,46.79 22.86,46.33 25.91,43.28 29.57,43.28 30.79,44.5 30.79,74.98 29.57,76.2 27.74,76.2 | v18.9,30.63 18.9,26.52 20.27,25.15 20.27,24.38 IC7.7
  Bottom 0.305: v18.9,30.63 16.92,32.61 v16.92,33.68
N$8
  Top 0.305: IC3.3 18.9,39.32 18.9,39.93 21.49,42.52 R6.1 21.64,42.67 23.93,42.67 R7.2
N$9  (via drill 0.61)
  Top 0.305: v4.27,31.09 5.18,32 5.18,53.34 7.01,55.17 7.01,58.06 6.1,58.98 6.1,91.75 7.01,92.66 7.92,92.66 8.84,91.75 8.84,88.39 10.67,86.56 11.58,86.56 12.34,85.8 12.34,82.14 10.06,79.86 10.06,69.19 10.67,68.58 11.43,68.58 12.34,67.67 12.34,64.16 10.06,61.87 10.06,51.82 10.82,51.05 11.58,51.05 14.17,48.46 22.1,48.46 28.19,54.56 28.96,54.56 R8.2 | v5.64,29.72 5.64,24.23 7.92,21.95 12.65,21.95 IC7.11 12.65,22.1 12.65,24.23 IC7.10
  Bottom 0.305: v5.64,29.72 v4.27,31.09
N$10
  Top 0.305: R9.2 26.52,44.5 28.96,44.5 R8.1 28.96,44.65 30.18,45.87 30.18,55.02 29.41,55.78 29.26,55.78 25.6,59.44 C1.1
N$11
  Top 0.305: IC2.3 18.9,52.12 22.86,52.12 C4.1 23.01,52.12 25.45,54.56 26.36,54.56 R9.1
N$12
  Top 0.305: 16.54,52.05 18.75,49.84 IC2.2 | 16.54,52.05 16.46,52.12 11.28,52.12 IC2.6 | 16.54,52.05 16.61,52.12 16.61,54.25 20.42,58.06 20.42,59.44 C1.2 20.57,59.59 22.86,59.59 28.04,64.77 28.96,64.77 R10.2
N$13
  Top 0.305: 16.54,69.57 18.75,67.36 IC4.2 | 16.54,69.57 16.46,69.65 11.28,69.65 IC4.6 | 21.57,80.24 19.96,81.84 19.96,86.56 18.9,87.63 IC5.3 | 21.57,80.24 24.23,77.57 25.45,77.57 C9.2 | 21.57,80.24 16.61,75.29 16.61,69.65 16.54,69.57
N$14  (via drill 0.61)
  Top 0.305: v23.62,72.08 20.57,75.13 20.57,77.42 C9.1 | v24.99,70.71 24.99,69.19 21.79,65.99 21.79,64.47 22.55,63.7 25.3,63.7 26.36,64.77 R11.2 26.52,64.92 28.96,67.36 28.96,74.98 R10.1
  Bottom 0.305: v24.99,70.71 v23.62,72.08
N$15
  Top 0.305: IC4.3 18.9,69.8 22.71,69.8 22.86,69.95 C10.1 23.01,70.1 26.36,73.46 26.36,74.98 R11.1
N$16
  Top 0.305: R14.1 109.12,71.02 110.19,71.02 114.15,74.98 +5V.A
N$17
  Top 0.305: R12.1 23.01,81.38 25.45,81.38 R17.2 25.6,81.38 27.89,81.38 R13.2 28.04,81.38 29.26,81.38 | 29.26,81.38 30.48,81.38 R16.2 | 29.26,81.38 29.26,92.05 28.5,92.81 28.5,94.18 27.74,94.94 21.79,94.94 17.68,90.83 17.68,87.17 18.75,86.11 18.75,85.34 IC5.2
N$18
  Top 0.305: R13.1 27.89,91.59 27.89,92.35 26.52,93.73 JP1.1
N$20
  Top 0.305: R4.1 112.01,70.1 114.15,70.1 +9V.A
N$21
  Top 0.305: R18.2 40.54,7.01 42.98,9.45 42.98,11.43 41.76,12.65 IC13.15 41.76,12.8 42.98,14.02 42.98,15.7 41.76,16.92 41.76,17.68 IC13.13
N$22
  Top 0.305: R16.1 30.48,91.59 30.48,93.73 JP2.1
N$23
  Top 0.305: R18.1 50.44,7.01 48.01,9.45 48.01,11.43 49.23,12.65 IC13.2 49.38,12.8 50.6,14.02 50.6,20.88 49.38,22.1 49.38,22.71 IC13.6
N$24
  Top 0.305: R17.1 25.45,91.59 25.15,91.59 23.01,93.73 JP3.1
N$25
  Top 0.305: R20.1 55.47,9.91 52.58,9.91 L4.2 52.43,10.06 49.38,10.06 IC13.1
N$26
  Top 0.305: IC1.4 92.2,31.39 92.2,35.51 93.12,36.42 C2.-
N$27
  Top 0.305: IC1.2 97.23,31.39 97.23,35.05 95.86,36.42 C2.+
N$28
  Top 0.305: L3.2 35.05,9.45 37.95,9.45 R19.1 38.1,9.45 38.71,10.06 41.6,10.06 IC13.16
N$29  (via drill 0.61)
  Top 0.305: R29.2 51.97,92.51 51.97,89.92 50.75,88.7 50.75,81.99 53.19,79.55 53.19,70.56 52.12,69.49 52.12,65.99 C21.2 52.27,65.99 55.47,65.99 55.63,66.14 58.98,66.14 59.74,65.38 v59.74,60.66 | 45.8,40.62 48.16,38.25 IC10.2 48.16,38.1 46.48,36.42 46.48,31.39 45.41,30.33 v45.41,29.41 | 45.8,40.62 45.72,40.69 40.69,40.69 IC10.6 | 45.8,40.62 45.87,40.69 45.87,42.52 51.66,48.31 51.97,48.31 C17.2 51.97,48.16 55.47,44.65 56.39,44.65 57.15,45.41 57.15,46.18 59.74,48.77 v59.74,58.22 | v47.4,27.28 49.23,25.45 IC13.7
  Bottom 0.305: v47.4,27.28 45.41,29.26 v45.41,29.41 | v59.74,58.22 v59.74,60.66
N$30
  Top 0.305: IC10.3 48.31,40.84 50.9,43.43 R23.1 51.05,43.59 53.95,43.59 R24.2
N$31
  Top 0.305: R25.2 58.37,45.87 58.37,42.67 47.09,31.39 47.09,29.72 42.82,25.45 41.76,25.45 IC13.10 41.76,25.3 41.76,22.86 IC13.11
N$32  (via drill 0.61)
  Top 0.305: v56.24,60.66 55.93,60.96 54.56,60.96 C16.1 | v56.39,58.22 58.52,56.08 R25.1 58.37,55.93 56.08,53.65 56.08,46.02 R26.2
  Bottom 0.305: v56.24,60.66 56.39,60.5 v56.39,58.22
N$33
  Top 0.305: IC6.3 48.31,53.34 51.82,53.34 51.97,53.49 C17.1 52.12,53.65 54.41,55.93 55.93,55.93 R26.1
N$34  (via drill 0.61)
  Top 0.305: 45.8,53.11 48.16,50.75 IC6.2 | 45.8,53.11 45.72,53.19 40.69,53.19 IC6.6 | C16.2 49.53,61.11 53.03,61.11 55.63,63.7 57.3,63.7 58.37,64.77 R27.2 | v47.09,58.22 45.87,57 45.87,53.19 45.8,53.11
  Bottom 0.305: v47.09,58.22 49.38,60.5 49.38,60.96 C16.2
N$35
  Top 0.305: R27.1 58.37,75.13 56.08,75.13 R28.2 56.08,75.29 54.56,76.81 54.56,78.49 C20.1
N$36
  Top 0.305: 50.75,71.17 48.31,71.17 IC11.3 | 50.75,71.17 51.97,71.17 C21.1 | 50.75,71.17 50.75,65.53 51.51,64.77 55.93,64.77 R28.1
N$37
  Top 0.305: 47.09,68.73 43.13,68.73 40.69,71.17 IC11.6 | 47.09,68.73 48.16,68.73 IC11.2 | 47.09,68.73 47.09,74.22 49.38,76.5 49.38,78.49 C20.2 49.38,78.64 47.09,80.92 47.09,86.87 48.16,87.94 48.16,88.7 IC12.3
N$38
  Top 0.305: R31.2 59.44,82.45 57.15,82.45 R30.2 56.84,82.45 54.56,82.45 R32.2 54.41,82.45 54.1,82.45 53.11,83.44 | 53.11,83.44 52.12,82.45 R29.1 | 53.11,83.44 53.19,83.52 53.19,93.12 52.58,93.73 51.51,93.73 50.75,92.96 50.75,89.61 48.31,87.17 48.31,86.26 IC12.2
N$39
  Top 0.305: R5.1 109.12,58.52 109.12,59.89 114.15,64.92 -9V.A
N$40
  Top 0.305: R30.1 57,92.66 57,94.18 56.08,95.1 JP4.1
N$41
  Top 0.305: R31.1 59.59,92.66 59.59,95.1 JP5.1
N$42
  Top 0.305: R32.1 54.41,92.66 53.8,93.27 53.8,93.42 52.12,95.1 JP6.1
N$43
  Top 0.305: R33.2 69.95,7.01 69.95,7.47 72.08,9.6 72.08,11.28 70.71,12.65 IC18.15 70.71,12.8 73.61,15.7 73.61,17.07 72.85,17.83 70.71,17.83 IC18.13
N$44
  Top 0.305: R33.1 80.01,7.01 79.55,7.01 76.96,9.6 76.96,11.43 78.18,12.65 IC18.2 78.18,12.8 76.96,14.02 76.96,20.73 78.18,21.95 78.18,22.71 IC18.6
N$45
  Top 0.305: R35.1 83.36,9.91 81.08,9.91 L6.2 80.92,10.06 78.33,10.06 IC18.1
N$46  (via drill 0.61)
  Top 0.559: C14.2 105.46,69.95 104.09,68.58 101.8,68.58 IC8.3 101.65,68.28 101.65,65.99 97.84,62.18 C15.+ 97.69,61.87 95.86,61.87 | 95.86,61.87 93.12,61.87 91.59,63.4 D2.C | 95.86,57.45 93.57,55.17 92.05,55.17 D1.C | 95.86,61.87 95.86,57.45 | 100.28,43.89 100.89,43.28 C53.+ | 100.28,43.89 99.36,44.81 99.36,46.94 7809L.IN 99.36,47.24 100.89,48.77 100.89,51.36 C57.2 101.19,51.51 102.11,51.51 103.94,53.34 v104.24,53.34 | 99.82,21.03 99.82,23.62 IC1.8 99.82,23.93 106.38,30.48 J1.3 | 99.82,21.03 100.43,20.42 C63.+ | 100.28,43.89 94.34,37.95 92.66,37.95 90.07,35.36 90.07,18.75 91.14,17.68 96.47,17.68 99.82,21.03 | v102.56,55.02 100.74,55.02 98.45,57.3 96.01,57.3 95.86,57.45
  Bottom 0.559: v104.24,53.34 v102.56,55.02
N$52
  Top 0.305: L5.2 64.62,9.91 67.36,9.91 R34.1 67.51,10.06 70.56,10.06 IC18.16
N$53  (via drill 0.61)
  Top 0.305: 75.82,36.65 74.52,35.36 74.37,35.36 73.61,34.59 73.61,33.98 76.96,30.63 76.96,26.67 78.18,25.45 IC18.7 | 75.82,36.65 77.27,38.1 IC15.2 | 75.89,46.18 76.66,46.94 79.1,46.94 80.47,48.31 C28.2 | 75.89,46.18 71.09,41.38 | 71.09,41.38 70.56,40.84 69.8,40.84 IC15.6 | 74.75,59.36 70.87,55.47 70.87,55.32 69.95,54.41 69.19,54.41 68.43,53.65 68.43,52.88 69.34,51.97 70.1,51.97 75.89,46.18 | 74.75,59.36 78.18,62.79 78.33,62.79 81.38,65.84 C32.2 | 74.75,59.36 66.29,67.82 66.29,70.71 67.36,71.78 67.36,73.15 70.87,76.66 70.87,83.97 76.81,89.92 77.57,89.92 80.16,92.51 81.38,92.51 R44.2 | v74.37,38.1 75.82,36.65 | 71.09,41.38 v73,39.47
  Bottom 0.305: v73,39.47 v74.37,38.1
N$54
  Top 0.305: 81.84,33.38 82.45,33.38 R38.1 | 81.84,33.38 80.01,33.38 R39.2 | 81.84,33.38 81.84,39.01 80.16,40.69 77.42,40.69 IC15.3
N$55  (via drill 0.61)
  Top 0.305: v58.22,29.11 65.99,36.88 71.78,36.88 76.81,41.91 82.45,41.91 83.67,43.13 83.67,44.04 83.52,44.2 83.52,45.87 R40.2 | v56.54,27.43 57.15,27.43 61.72,22.86 70.56,22.86 IC18.11 70.56,23.01 70.56,25.3 IC18.10
  Bottom 0.305: v56.54,27.43 v58.22,29.11
N$56
  Top 0.305: 83.29,56.77 79.1,60.96 C27.1 | 83.29,56.77 83.36,56.69 83.36,56.08 R40.1 | 83.29,56.77 83.82,57.3 86.87,57.3 87.63,56.54 87.63,55.63 86.56,54.56 86.56,46.02 R41.2
N$57
  Top 0.305: IC14.3 77.42,53.34 80.31,53.34 80.47,53.49 C28.1 80.62,53.65 82.75,53.65 85.04,55.93 86.41,55.93 R41.1
N$58
  Top 0.559: C12.- 92.05,19.66 92.05,23.62 IC1.5 92.35,23.93 97.69,29.26 100.28,29.26 102.41,31.39 102.41,45.41 101.35,46.48 101.35,47.4 102.72,48.77 103.78,48.77 7909L.IN 104.09,48.92 104.09,51.36 C55.1 104.24,51.51 105.31,52.58 108.36,52.58 C54.- 108.66,52.88 109.27,53.49 114.45,53.49 D4.A
N$60
  Top 0.305: 76.05,50.75 72.24,50.75 69.8,53.19 IC14.6 | 76.05,50.75 77.27,50.75 IC14.2 | 82.75,61.11 80.47,61.11 79.4,62.18 78.49,62.18 76.05,59.74 76.05,50.75 | 82.75,61.11 83.97,61.11 C27.2 | 82.75,61.11 82.75,66.29 79.1,69.95 76.96,69.95 76.05,70.87 76.05,71.63 76.81,72.39 77.57,72.39 78.64,73.46 84.89,73.46 R42.2
N$61
  Top 0.305: R42.1 85.04,63.4 85.8,63.4 87.02,62.18 87.94,62.18 88.7,62.94 88.7,72.39 87.63,73.46 R43.2 87.48,73.61 84.12,76.96 84.12,78.49 C31.1
N$62
  Top 0.305: R43.1 87.48,63.55 87.48,65.08 81.53,71.02 C32.1 81.38,71.17 77.42,71.17 IC16.3
N$63
  Top 0.305: 71.4,70.94 73.61,68.73 77.27,68.73 IC16.2 | 71.4,70.94 71.17,71.17 69.8,71.17 IC16.6 | 71.4,70.94 78.94,78.49 C31.2 78.94,78.64 76.05,81.53 76.05,86.56 77.27,87.78 77.27,88.7 IC17.3
N$64
  Top 0.305: R46.2 88.85,82.45 86.56,82.45 R45.2 86.41,82.45 84.12,82.45 R47.2 83.97,82.45 81.53,82.45 R44.1 81.38,82.45 77.72,86.11 77.42,86.11 IC17.2
N$66
  Top 0.305: R45.1 86.41,92.66 86.41,93.73 85.04,95.1 JP7.1
N$67
  Top 0.305: R46.1 89,92.66 89,95.1 JP8.1
N$68
  Top 0.305: R47.1 83.97,92.66 81.53,95.1 JP9.1
VCC  (via drill 0.61)
  Top 0.559: C22.1 38.1,50.9 40.39,50.9 40.54,50.75 IC6.7 | C22.1 37.95,51.21 37.03,52.12 37.03,53.19 C61.+ 37.03,53.49 37.03,53.8 38.41,55.17 38.41,59.44 | IC10.7 40.54,38.1 38.1,38.1 C26.1 37.95,38.25 37.03,39.17 37.03,39.32 | 37.03,39.32 37.03,41.6 C58.+ 37.19,41.91 38.41,43.13 38.41,50.75 C22.1 | C25.1 38.1,86.41 40.39,86.41 40.54,86.26 IC12.7 | C51.+ 37.03,88.7 37.03,87.63 37.95,86.72 C25.1 | C23.1 38.1,68.58 40.54,68.58 IC11.7 | C23.1 37.95,68.73 37.03,69.65 37.03,72.08 C48.+ 37.19,72.39 38.41,73.61 38.41,86.26 C25.1 | 38.41,59.44 38.41,68.43 C23.1 | C11.1 9.14,85.04 10.97,85.04 11.12,85.19 IC5.7 | C50.+ 7.62,88.7 7.62,86.41 8.84,85.19 C11.1 | C6.1 9.14,67.36 11.12,67.36 IC4.7 | C6.1 8.84,67.67 7.62,68.89 7.62,71.17 C47.+ 7.62,71.48 8.99,72.85 8.99,84.73 C11.1 | C5.1 9.14,48.62 10.06,48.62 11.12,49.68 IC2.7 | C5.1 8.99,48.77 7.62,50.14 7.62,51.21 C62.+ 7.77,51.36 8.99,52.58 8.99,67.21 C6.1 | C5.1 8.99,48.31 8.99,42.06 7.77,40.84 C56.+ 7.62,40.69 7.62,38.41 8.84,37.19 C13.1 9.14,36.88 10.97,36.88 IC3.7 11.28,36.73 15.54,32.46 21.49,32.46 R6.2 21.64,32.61 28.35,39.32 37.03,39.32 | 99.21,72.08 99.21,74.07 100.13,74.98 C46.+ 100.43,74.83 101.65,73.61 103.94,73.61 C24.2 104.09,73.76 108.97,78.64 108.97,81.08 R14.2 | 99.21,72.08 99.21,68.58 IC8.1 99.06,68.58 94.03,63.55 D3.C | 99.21,72.08 93.42,72.08 92.05,73.46 91.59,73.46 D2.A 91.29,73.76 90.68,73.76 84.58,79.86 82.14,79.86 77.42,75.13 76.81,75.13 73,71.32 v73,70.71 | 65.99,37.95 64.77,36.73 55.47,36.73 52.27,33.53 51.05,33.53 R23.2 | 65.99,37.95 67.51,37.95 C37.1 67.67,38.1 69.65,38.1 IC15.7 | 65.99,37.95 65.99,41.6 C60.+ 66.14,41.91 72.47,48.23
  Top 0.559: C36.1 67.67,86.41 69.49,86.41 69.65,86.26 IC17.7 | C36.1 67.51,86.26 64.47,83.21 64.47,74.22 65.99,72.69 C49.+ 65.84,72.08 65.84,71.32 64.47,69.95 64.47,59.44 | C52.+ 66.14,88.7 66.14,87.94 67.36,86.72 C36.1 | v67.51,70.56 67.51,68.73 C35.1 67.67,68.58 69.65,68.58 IC16.7 69.95,68.73 70.56,69.34 v71.63,69.34 | v75.89,44.81 76.05,44.96 80.47,44.96 81.84,43.59 82.45,43.59 R38.2 | 72.47,48.23 69.95,50.75 IC14.7 69.65,50.75 69.49,50.9 67.67,50.9 C34.1 67.36,51.21 66.14,52.43 66.14,54.71 C59.+ 65.84,54.86 64.47,56.24 64.47,59.44 | 72.47,48.23 v74.52,46.18 | 64.47,59.44 38.41,59.44
  Bottom 0.559: v67.51,70.56 67.51,70.71 66.14,72.08 C49.+ | v74.52,46.18 v75.89,44.81 | v71.63,69.34 v73,70.71
X+  (via drill 0.61)
  Top 0.305: L2.1 23.62,19.05 26.36,19.05 R3.2 26.52,19.2 27.74,20.42 v27.74,20.88 27.74,26.36 26.06,28.04 24.23,28.04 20.57,31.7 6.25,31.7 1.83,27.28 1.83,18.59 4.27,16.15 4.27,8.08 10.36,1.98 v29.57,1.98 | v98.91,8.53 89.46,8.53 83.67,2.74 31.55,2.74 v30.94,3.35
  Bottom 0.305: v27.74,20.88 29.41,19.2 R22.2 | v98.91,8.53 101.35,10.97 101.35,11.12 GEOIN.2 | v29.57,1.98 v30.94,3.35
X-  (via drill 0.61)
  Top 0.305: 4.88,19.05 5.94,19.05 L1.1 6.1,19.05 8.99,19.05 R2.2 | 4.88,19.05 3.05,19.05 R21.2 | v32.16,4.12 32.92,3.35 83.36,3.35 89.61,9.6 99.21,9.6 99.97,8.84 101.35,8.84 GEOIN.1 | v28.5,3.05 10.21,3.05 4.88,8.38 4.88,19.05
  Bottom 0.305: v32.16,4.12 31.85,4.42 29.87,4.42 v28.5,3.05
XOUT
  Top 0.305: IC5.6 11.28,87.78 13.72,87.78 22.1,96.16 22.86,96.16 JP3.2 23.01,96.32 26.36,96.32 JP1.2 26.52,96.32 30.48,96.32 JP2.2 30.63,96.32 33.98,99.67 97.69,99.67 101.65,95.71 101.65,94.79 102.41,94.03 103.33,94.03 104.24,93.12 104.24,92.35 103.33,91.44 102.56,91.44 101.35,92.66 100.43,92.66 ASPOUT.1
Y+  (via drill 0.61)
  Top 0.305: L4.1 52.58,20.12 55.47,20.12 R20.2 55.63,20.12 58.37,20.12 R37.2 58.52,19.96 59.74,18.75 59.74,10.06 65.38,4.42 v83.06,4.42 | v85.34,2.13 88.7,5.49 105,5.49 107.75,8.23 107.75,9.14 106.98,9.91 106.07,9.91 104.85,11.12 104.09,11.12 GEOIN.4
  Bottom 0.305: v83.06,4.42 v85.34,2.13
Y-  (via drill 0.61)
  Top 0.305: R19.2 37.95,19.66 35.05,19.66 L3.1 34.9,19.66 32.61,19.66 R36.2 32.46,19.51 31.24,18.29 31.24,8.99 29.72,7.47 v29.72,6.55 | v28.04,4.88 30.79,2.13 83.97,2.13 87.94,6.1 100.58,6.1 103.17,8.69 103.94,8.69 GEOIN.3
  Bottom 0.305: v29.72,6.55 v28.04,4.88
YOUT
  Top 0.305: IC12.6 40.69,88.85 43.13,88.85 51.97,97.69 JP6.2 52.12,97.84 55.93,97.84 JP4.2 56.08,97.84 59.44,97.84 JP5.2 59.59,97.84 60.81,99.06 90.22,99.06 93.88,95.4 100.28,95.4 ASPOUT.2
Z+  (via drill 0.61)
  Top 0.305: L6.1 81.08,20.12 83.36,20.12 R35.2 83.52,19.96 83.52,19.51 v84.43,18.59 | R49.2 86.11,19.96 86.11,17.83 91.44,12.5 105.16,12.5 106.38,11.28 GEOIN.6
  Bottom 0.305: v84.43,18.59 85.95,20.12 R49.2
Z-  (via drill 0.61)
  Top 0.305: R48.2 61.57,20.12 64.47,20.12 L5.1 64.62,20.12 67.36,20.12 R34.2 67.51,19.96 67.51,19.05 70.1,16.46 71.32,16.46 71.63,16.76 v72.54,16.76 | v73.91,18.14 73.91,20.27 77.72,24.08 81.23,24.08 84.73,20.57 84.73,19.66 85.5,18.9 85.5,17.53 91.14,11.89 97.84,11.89 99.67,10.06 104.39,10.06 105.61,8.84 106.38,8.84 GEOIN.5
  Bottom 0.305: v72.54,16.76 v73.91,18.14
ZOUT
  Top 0.305: IC17.6 69.8,88.85 72.54,88.85 81.38,97.69 JP9.2 81.53,97.84 84.89,97.84 JP7.2 85.04,97.84 88.85,97.84 JP8.2 89,97.69 92.66,94.03 100.89,94.03 102.11,92.81 102.87,92.81 ASPOUT.3

### Text on the board
Document: 50db | 60db | 80db | 50db | 60db | 80db | 50db | 60db | 80db